# Altium project AquaBot Stock Controller.PrjPcb
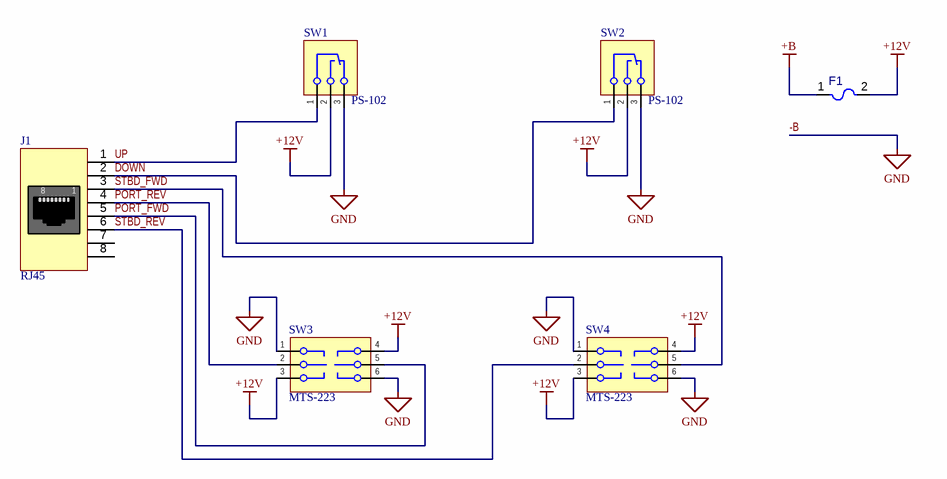
[diagram p0: AquaBot Stock Controller.SchDoc]
1 sheet, 6 parts. Net scope: global (net labels, ports and power ports of the same name join across sheets).
Board file: AquaBot Stock Controller.PcbDoc

## Sheet AquaBot Stock Controller.SchDoc: AquaBot Stock Controller
size A4; Organization: PEI; Address1: 22 Russell Crescent; Address2: Western Heights; Address3: Rotorua; Address4: New Zealand 3015; DocumentNumber: 1; Revision: 0; SheetNumber: 1; SheetTotal: 1

### Parts
F1  Automotive Micro Fuse Holder  [Automotive Micro Fuse Holder-Footprint-1]  (value not drawn)
J1  RJ45  [RJ45-Footprint-1]
SW1  PS-102  [PS-102-Footprint-RA]
SW2  PS-102  [PS-102-Footprint-RA]
SW3  MTS-223  [MTS-223-Footprint-1]
SW4  MTS-223  [MTS-223-Footprint-1]

### Nets
+12V: F1.2 SW1.2(NO) SW2.2(NO) SW3.3(NO_1B) SW3.4(NO_2A) SW4.3(NO_1B) SW4.4(NO_2A)
+B: F1.1
-B: SW1.3(NC) SW2.3(NC) SW3.1(NO_1A) SW3.6(NO_2B) SW4.1(NO_1A) SW4.6(NO_2B)  [also labelled GND]
DOWN: J1.2 SW2.1(C)
PORT_FWD: J1.5 SW3.5(C_2)
PORT_REV: J1.4 SW3.2(C_1)
STBD_FWD: J1.3 SW4.5(C_2)
STBD_REV: J1.6 SW4.2(C_1)
UP: J1.1 SW1.1(C)

Not connected (* = marked no-connect by the designer): J1 7 8

### Notes on the sheet
- Title
- Size:
- Date:
- A4
- Number:
- Time:
- Revision:
- Sheet
- of
- File:

### Library data of the parts
F1 = CMP-005-00000-1: PTH fuse holder
J1 = CMP-002-00005-1: Aliexpress RJ45 network interface full plastic 90 degree short body length of about 17.7MM network socket 8P8C socket - RJ-45-8P 5801-10P8C
SW1 SW2 = CMP-011-00002-1: Momentary push button std 6mm mounting
SW3 SW4 = CMP-011-00001-1: On Off On momentary toggle switch DPDT